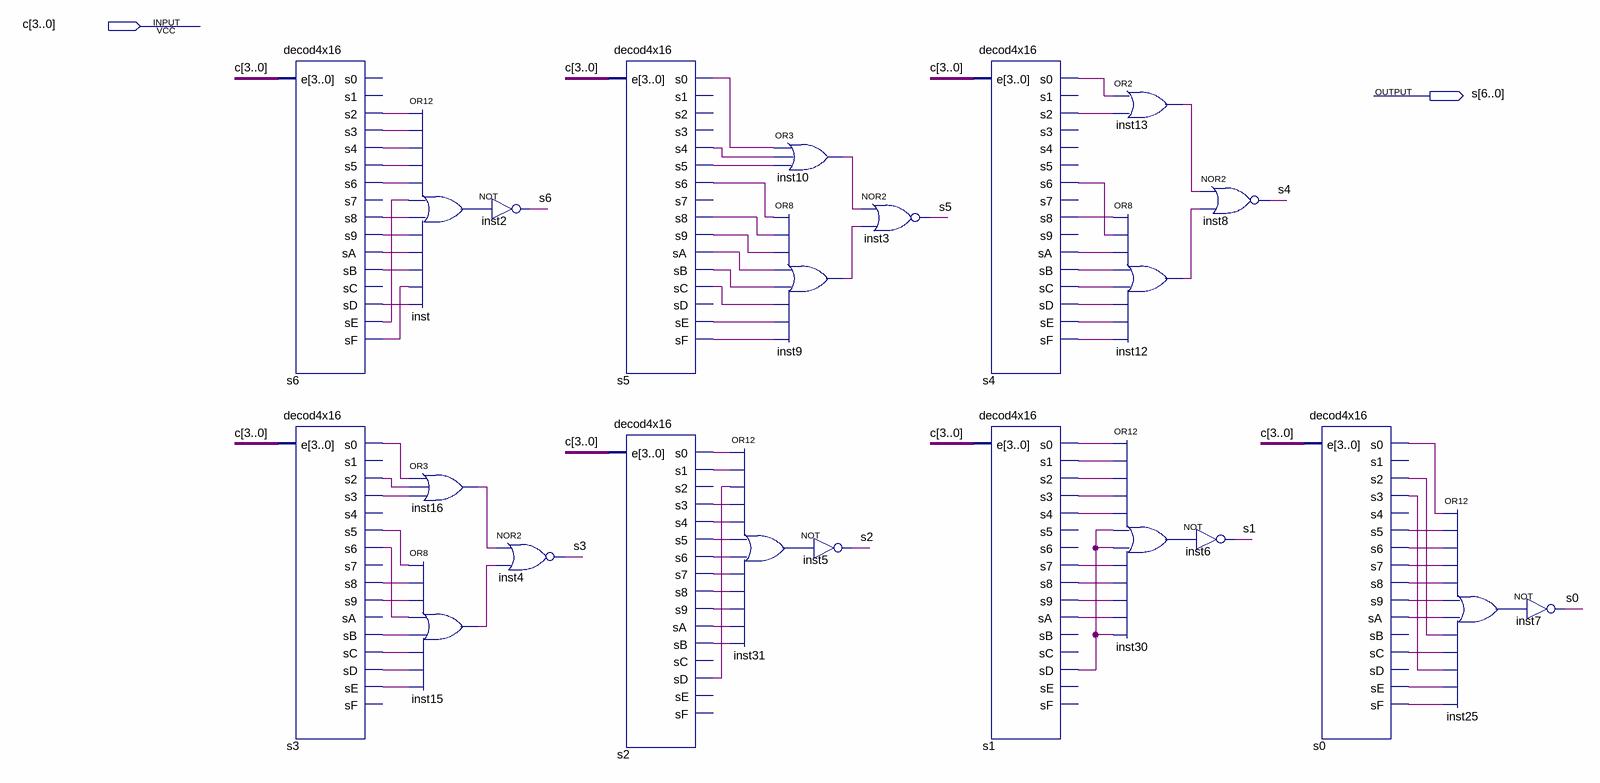
[diagram p0: schematic sheet]
// Quartus schematic display_7_seg.bdf as structural Verilog: 24 symbols, 2 pins
module display_7_seg (
  input  [3:0] c,
  output [6:0] s
);

  wire inst9_out, inst10_out, inst12_out, inst13_out, inst15_out, inst16_out, inst25_out, inst30_out,
       inst31_out, inst_out, s0_s0, s0_s2, s0_s3, s0_s5, s0_s6, s0_s7, s0_s8, s0_s9, s0_sa, s0_sc, s0_se,
       s0_sf, s1_s0, s1_s1, s1_s2, s1_s3, s1_s4, s1_s7, s1_s8, s1_s9, s1_sa, s1_sd, s2_s0, s2_s1, s2_s3,
       s2_s4, s2_s5, s2_s6, s2_s7, s2_s8, s2_s9, s2_sa, s2_sb, s2_sd, s3_s0, s3_s2, s3_s3, s3_s5, s3_s6,
       s3_s8, s3_s9, s3_sb, s3_sc, s3_sd, s3_se, s4_s0, s4_s2, s4_s6, s4_s8, s4_sa, s4_sb, s4_sc, s4_sd,
       s4_se, s4_sf, s5_s0, s5_s4, s5_s5, s5_s6, s5_s8, s5_s9, s5_sa, s5_sb, s5_sc, s5_se, s5_sf, s6_s2,
       s6_s3, s6_s4, s6_s5, s6_s6, s6_s8, s6_s9, s6_sa, s6_sb, s6_sd, s6_se, s6_sf;

  decod4x16 s6 (
    .e(c), .s2(s6_s2), .s3(s6_s3), .s4(s6_s4), .s5(s6_s5), .s6(s6_s6), .s8(s6_s8), .s9(s6_s9), .sA(s6_sa),
    .sB(s6_sb), .sD(s6_sd), .sE(s6_se), .sF(s6_sf));  // open: s0, s1, s7, sC
  decod4x16 s3 (
    .e(c), .s0(s3_s0), .s2(s3_s2), .s3(s3_s3), .s5(s3_s5), .s6(s3_s6), .s8(s3_s8), .s9(s3_s9), .sB(s3_sb),
    .sC(s3_sc), .sD(s3_sd), .sE(s3_se));  // open: s1, s4, s7, sA, sF
  or inst (inst_out, s6_s2, s6_s3, s6_s4, s6_s5, s6_s6, s6_se, s6_s8, s6_s9, s6_sa, s6_sb, s6_sf, s6_sd);
  or inst16 (inst16_out, s3_s0, s3_s2, s3_s3);
  or inst15 (inst15_out, s3_s5, s3_s8, s3_s9, s3_s6, s3_sb, s3_sc, s3_sd, s3_se);
  not inst2 (s[6], inst_out);
  nor inst4 (s[3], inst16_out, inst15_out);
  decod4x16 s5 (
    .e(c), .s0(s5_s0), .s4(s5_s4), .s5(s5_s5), .s6(s5_s6), .s8(s5_s8), .s9(s5_s9), .sA(s5_sa), .sB(s5_sb),
    .sC(s5_sc), .sE(s5_se), .sF(s5_sf));  // open: s1, s2, s3, s7, sD
  decod4x16 s2 (
    .e(c), .s0(s2_s0), .s1(s2_s1), .s3(s2_s3), .s4(s2_s4), .s5(s2_s5), .s6(s2_s6), .s7(s2_s7), .s8(s2_s8),
    .s9(s2_s9), .sA(s2_sa), .sB(s2_sb), .sD(s2_sd));  // open: s2, sC, sE, sF
  or inst31 (inst31_out, s2_s0, s2_s1, s2_sd, s2_s3, s2_s4, s2_s5, s2_s6, s2_s7, s2_s8, s2_s9, s2_sa, s2_sb);
  or inst10 (inst10_out, s5_s0, s5_s4, s5_s5);
  or inst9 (inst9_out, s5_s6, s5_s8, s5_s9, s5_sa, s5_sb, s5_sc, s5_se, s5_sf);
  not inst5 (s[2], inst31_out);
  nor inst3 (s[5], inst10_out, inst9_out);
  decod4x16 s4 (
    .e(c), .s0(s4_s0), .s2(s4_s2), .s6(s4_s6), .s8(s4_s8), .sA(s4_sa), .sB(s4_sb), .sC(s4_sc), .sD(s4_sd),
    .sE(s4_se), .sF(s4_sf));  // open: s1, s3, s4, s5, s7, s9
  decod4x16 s1 (
    .e(c), .s0(s1_s0), .s1(s1_s1), .s2(s1_s2), .s3(s1_s3), .s4(s1_s4), .s7(s1_s7), .s8(s1_s8), .s9(s1_s9),
    .sA(s1_sa), .sD(s1_sd));  // open: s5, s6, sB, sC, sE, sF
  or inst13 (inst13_out, s4_s0, s4_s2);
  or inst12 (inst12_out, s4_s8, s4_s6, s4_sa, s4_sb, s4_sc, s4_sd, s4_se, s4_sf);
  or inst30 (inst30_out, s1_s0, s1_s1, s1_s2, s1_s3, s1_s4, s1_sd, s1_sd, s1_s7, s1_s8, s1_s9, s1_sa, s1_sd);
  nor inst8 (s[4], inst13_out, inst12_out);
  not inst6 (s[1], inst30_out);
  decod4x16 s0 (
    .e(c), .s0(s0_s0), .s2(s0_s2), .s3(s0_s3), .s5(s0_s5), .s6(s0_s6), .s7(s0_s7), .s8(s0_s8), .s9(s0_s9),
    .sA(s0_sa), .sC(s0_sc), .sE(s0_se), .sF(s0_sf));  // open: s1, s4, sB, sD
  or inst25 (inst25_out, s0_s0, s0_s5, s0_s6, s0_s7, s0_s8, s0_s9, s0_sa, s0_s2, s0_sc, s0_s3, s0_se, s0_sf);
  not inst7 (s[0], inst25_out);
endmodule
